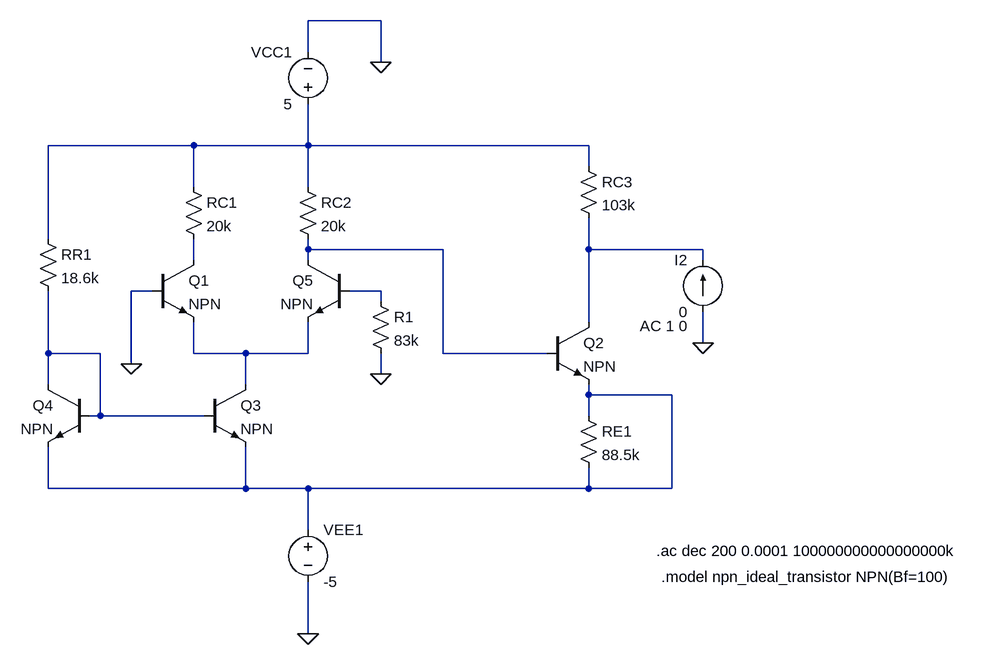
[diagram p0: schematic Draft2.asc]
Draft2.asc, the LTspice schematic file:
Version 4
SHEET 1 1388 880
WIRE 464 -80 352 -80
WIRE 352 -32 352 -80
WIRE 464 -16 464 -80
WIRE 176 112 -48 112
WIRE 352 112 352 48
WIRE 352 112 176 112
WIRE 784 112 352 112
WIRE 784 144 784 112
WIRE 176 176 176 112
WIRE 352 176 352 112
WIRE -48 256 -48 112
WIRE 352 272 352 256
WIRE 560 272 352 272
WIRE 784 272 784 224
WIRE 960 272 784 272
WIRE 176 288 176 256
WIRE 352 288 352 272
WIRE 960 288 960 272
WIRE 112 336 80 336
WIRE 464 336 416 336
WIRE 464 352 464 336
WIRE 784 384 784 272
WIRE 960 416 960 368
WIRE -48 432 -48 336
WIRE 32 432 -48 432
WIRE 176 432 176 384
WIRE 256 432 176 432
WIRE 352 432 352 384
WIRE 352 432 256 432
WIRE 560 432 560 272
WIRE 720 432 560 432
WIRE 80 448 80 336
WIRE 464 464 464 432
WIRE -48 480 -48 432
WIRE 256 480 256 432
WIRE 784 496 784 480
WIRE 912 496 784 496
WIRE 32 528 32 432
WIRE 32 528 16 528
WIRE 192 528 32 528
WIRE 784 528 784 496
WIRE -48 640 -48 576
WIRE 256 640 256 576
WIRE 256 640 -48 640
WIRE 352 640 256 640
WIRE 784 640 784 608
WIRE 784 640 352 640
WIRE 912 640 912 496
WIRE 912 640 784 640
WIRE 352 704 352 640
WIRE 352 864 352 784
FLAG 960 416 0
FLAG 352 864 0
FLAG 464 -16 0
FLAG 80 448 0
FLAG 464 464 0
SYMBOL res 160 160 R0
SYMATTR InstName RC1
SYMATTR Value 20k
SYMBOL res 336 160 R0
SYMATTR InstName RC2
SYMATTR Value 20k
SYMBOL Res 768 512 R0
SYMATTR InstName RE1
SYMATTR Value 88.5k
SYMBOL Res -64 240 R0
SYMATTR InstName RR1
SYMATTR Value 18.6k
SYMBOL Res 768 128 R0
SYMATTR InstName RC3
SYMATTR Value 103k
SYMBOL npn 112 288 R0
SYMATTR InstName Q1
SYMBOL npn 720 384 R0
SYMATTR InstName Q2
SYMBOL npn 192 480 R0
SYMATTR InstName Q3
SYMBOL npn 16 480 M0
SYMATTR InstName Q4
SYMBOL npn 416 288 M0
SYMATTR InstName Q5
SYMBOL voltage 352 688 R0
SYMATTR InstName VEE1
SYMATTR Value -5
SYMBOL voltage 352 64 R180
WINDOW 0 24 96 Left 2
WINDOW 3 24 16 Left 2
SYMATTR InstName VCC1
SYMATTR Value 5
SYMBOL Res 448 336 R0
SYMATTR InstName R1
SYMATTR Value 83k
SYMBOL current 960 368 R180
WINDOW 0 24 80 Left 2
WINDOW 3 24 0 Left 2
WINDOW 123 24 -22 Left 2
SYMATTR InstName I2
SYMATTR Value 0
SYMATTR Value2 AC 1 0
TEXT 888 736 Left 2 !.ac dec 200 0.0001 100000000000000000k
TEXT 896 776 Left 2 !.model npn_ideal_transistor NPN(Bf=100)

The netlist it stands for:
* Draft2.asc
RC1 N001 N004 20k
RC2 N001 N002 20k
RE1 N008 N008 88.5k
RR1 N001 N006 18.6k
RC3 N001 N003 103k
Q1 N004 0 N007 0 NPN
Q2 N003 N002 N008 0 NPN
Q3 N007 N006 N008 0 NPN
Q4 N006 N006 N008 0 NPN
Q5 N002 N005 N007 0 NPN
VEE1 N008 0 -5
VCC1 N001 0 5
R1 N005 0 83k
I2 0 N003 0 AC 1 0
.model NPN NPN
.model PNP PNP
.lib standard.bjt
.ac dec 200 0.0001 100000000000000000k
.model npn_ideal_transistor NPN(Bf=100)
.backanno
.end